# EAGLE schematic WallSwitch (EAGLE 8.0.1)
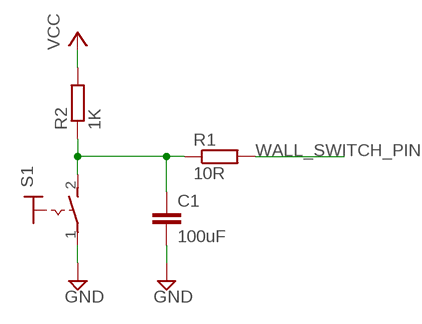
[diagram p0: schematic, sheet 1]

## Parts
C1  100uF  C-EU025-024X044  [C025-024X044]
R1  10R  R-EU_0204/5  [0204/5]
R2  1K  R-EU_0204/5  [0204/5]
S1  MS243  [MS243]

## Nets
GND: S1.1(P)
N$1: C1.1 R1.1 R2.1 S1.2(S)
N$2: C1.2 ; supply symbol labelled GND
VCC: R2.2
WALL_SWITCH_PIN: R1.2

## Library data of the parts
C1 = resistor:C-EU: CAPACITOR, European symbol
R1 R2 = resistor:R-EU_: RESISTOR, European symbol
S1 = switch:MS243: TOGGLE SWITCH